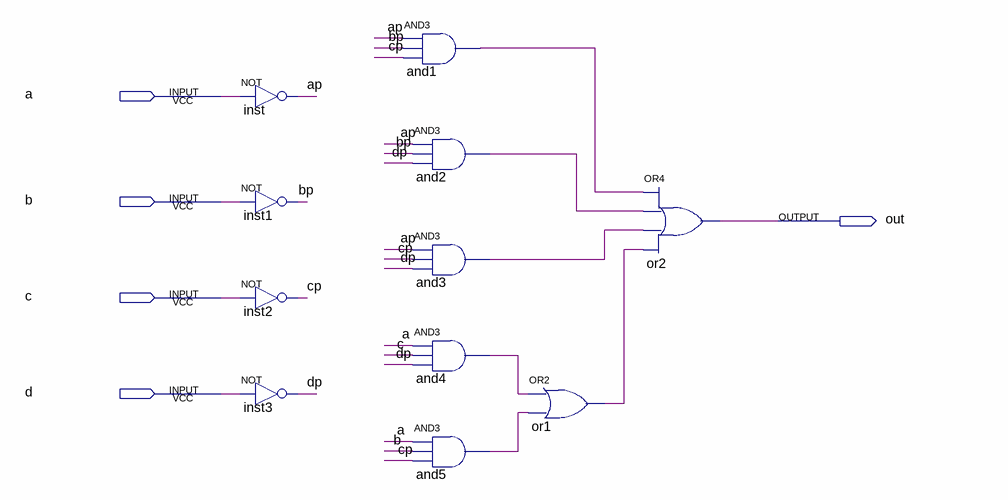
[diagram p0: schematic sheet]
// Quartus schematic SOP.bdf as structural Verilog: 11 symbols, 5 pins
module SOP (
  input  a,
  input  b,
  input  c,
  input  d,
  output out
);

  wire and1_out, and2_out, and3_out, and4_out, and5_out, ap, bp, cp, dp, or1_out;

  not inst (ap, a);
  not inst1 (bp, b);
  not inst2 (cp, c);
  not inst3 (dp, d);
  and and1 (and1_out, ap, bp, cp);
  and and2 (and2_out, ap, bp, dp);
  and and3 (and3_out, ap, cp, dp);
  and and4 (and4_out, a, c, dp);
  and and5 (and5_out, a, b, cp);
  or or1 (or1_out, and4_out, and5_out);
  or or2 (out, and1_out, and2_out, and3_out, or1_out);
endmodule
